# Altium schematic sheet DSD_SDR_MainBoard_Single.SchDoc
size A4; SheetNumber: 1; SheetTotal: 1; SPICEModelCacheQBMOYUVP: <root> / <DocumentId>QBMOYUVP</DocumentId> / </root>
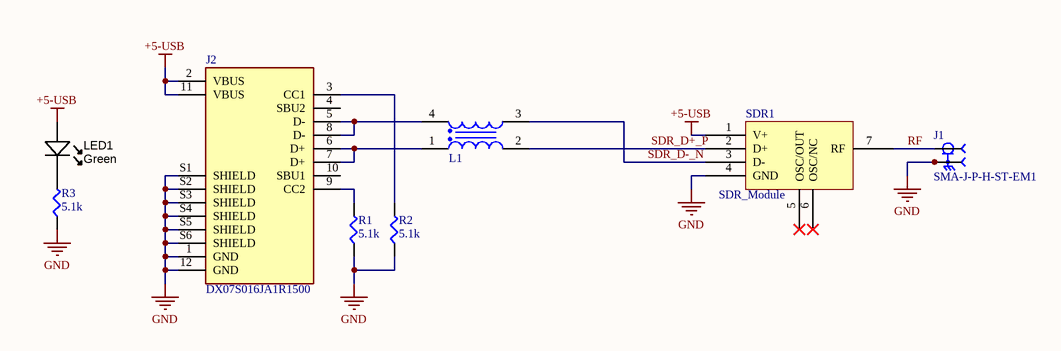
[diagram p0: DSD_SDR_MainBoard_Single.SchDoc]

## Parts
J1  SMA-J-P-H-ST-EM1  [SAMTEC_SMA-J-P-H-ST-EM1]
J2  DX07S016JA1R1500  [JAE_DX07S016JA1R1500]
L1  90Ohm  [WE-CNSW_1206]  (value not drawn)
LED1  Green  [LED-0603-GREEN]
R1  5.1k  [SMD-0603-RES]
R2  5.1k  [SMD-0603-RES]
R3  5.1k  [SMD-0603-RES]
SDR1  SDR_Module  [SDR]

## Nets
+5-USB: J2.2(VBUS) J2.11(VBUS) LED1.A SDR1.1(V+)
GND: J1.2_1 J1.2_2 J1.3_1 J1.3_2 J2.1(GND) J2.12(GND) J2.S1(SHIELD) J2.S2(SHIELD) J2.S3(SHIELD) J2.S4(SHIELD) J2.S5(SHIELD) J2.S6(SHIELD) R1.1 R2.1 R3.1 SDR1.4(GND)
RF: J1.1 SDR1.7(RF)
SDR_D+_P: L1.2 SDR1.2(D+)
SDR_D-_N: L1.3 SDR1.3(D-)
NetJ2_3: J2.3(CC1) R2.2
NetJ2_5: J2.5(D-) J2.8(D-) L1.4
NetJ2_6: J2.6(D+) J2.7(D+) L1.1
NetJ2_9: J2.9(CC2) R1.2
NetLED1_K: LED1.K R3.2

Not connected (* = marked no-connect by the designer): J2 4(SBU2) 10(SBU1); SDR1 5(OSC/OUT)* 6(OSC/NC)*

## Library data of the parts
J1 = SMA-J-P-H-ST-EM1: SMA Connector Jack, Female Socket 50Ohm Board Edge, End Launch Solder; MF: Samtec; Package: None; Price: None; Value: *; MP: SMA-J-P-H-ST-EM1; Availability: Unavailable
J2 = DX07S016JA1R1500: USB-C (USB TYPE-C) USB 2.0 Receptacle Connector 24 (16+8 Dummy) Position Surface Mount, Right Angle; Through Hole; Package: None; Value: *; Price: None; MP: DX07S016JA1R1500; Availability: Unavailable
L1 = 744232090: WE-CNSW SMT Common Mode Line Filter, size 1206, 90Ohm, 0.111uH, 50V; Manufacturer: Wurth Elektronik; Case/Size Code: 1206; DC Resistance Max: 0.3Ohm; Insulation Test Voltage: 125VAC; Rated Current: 0.37A; Winding Style: bifiliar; ComponentLink1Description: Manufacturer Link; ComponentLink1URL: https://www.we-online.com/redexpert/article/744232090?ad; ComponentLink2Description: Datasheet; ComponentLink2URL: https://www.we-online.com/redexpert/spec/744232090?ad; Category: Common Mode Chokes; Match Code: WE-CNSW; Manufacturer Part Number: 744232090; Mount: Surface Mount; Operating Temperature Max: 125°C; Operating Temperature Min: -40°C; Packaging: Tape and Reel; Length: 3.2mm; Width: 1.6mm; Height: 1.8mm; Impedance @100MHz: 90Ohm; Inductance: 0.111uH; Rated Voltage: 50V
LED1 = LED_SMD_Green_0603_570nm: LED 0603 SMD Green 570nm 50mcd 20mA; Manufacturer 1: Kingbright Company LLC; Manufacturer Part Number 1: APT1608CGCK; Material: AlGaInP; Ratings: 20mcd min; 50 mcd typ; 570 nm; Voltage - Forward (Vf) Typ: 2.1V; Viewing Angle: 120°; Lens Style/Size: Rectangle with Flat Top, 1.1mm x 0.8mm; Voltage - Forward (Vf) @ 10mA: 2.0V; SCDType: source; Wavelength - Peak: 574nm; Lens Type: Clear; Package / Case: 0603 (1608 metric); Color: Green; Current - Test: 20mA; Supplier 1: Digi-Key; Supplier Part Number 1: 754-1116-1-ND; RoHS 1: RoHS Compliant; Wavelength - Dominant: 570nm; ComponentLink1URL: http://www.us.kingbright.com/images/catalog/SPEC/APT1608CGCK.pdf; ComponentLink1Description: http://www.us.kingbright.com/images/catalog/SPEC/APT1608CGCK.pdf
R1-R3 = ERJ-3EKF5101V: RES SMD 5.1K OHM 1% 1/10W 0603; Manufacturer: Panasonic Electronic Components; Factory Stock: 0; Unit Price (USD): 0.00379; @ qty: 1500; Minimum Quantity: 1; Power (Watts): 0.1W, 1/10W; Temperature Coefficient: ±100ppm/°C; Part Number: ERJ-3EKF5101V; Datasheets: http://industrial.panasonic.com/www-cgi/jvcr13pz.cgi?E+PZ+3+AOA0002+ERJ3EKF5101V+7+WW; Image: //media.digikey.com/Photos/Panasonic%20Photos/MFG_ERJ-P6W%20Series.jpg; Digi-Key Part Number: P5.10KHCT-ND; Quantity Available: 159646; Packaging: Cut Tape (CT); Series: ERJ; Part Status: Active; Value: 5.1k; Tolerance: ±1%; Composition: Thick Film; Features: Automotive AEC-Q200; Operating Temperature: -55°C ~ 155°C; Package / Case: 0603 (1608 Metric); Supplier Device Package: 0603; Size / Dimension: 0.063" L x 0.031" W (1.60mm x 0.80mm); Height - Seated (Max): 0.022" (0.55mm); Number of Terminations: 2; Failure Rate: -